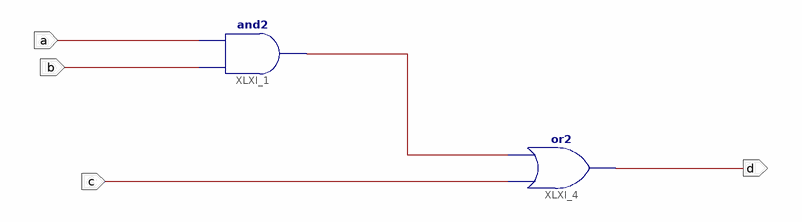
[diagram p0: schematic sheet 1]
// Xilinx ISE schematic funkcja1.sch (spartan3e) as structural Verilog: 2 symbols, 4 ports
module funkcja1 (
  input  a,
  input  b,
  input  c,
  output d
);

  wire XLXN_19;

  and XLXI_1 (XLXN_19, b, a);
  or XLXI_4 (d, c, XLXN_19);
endmodule
